# Altium schematic sheet Oscilador.SchDoc
size A4
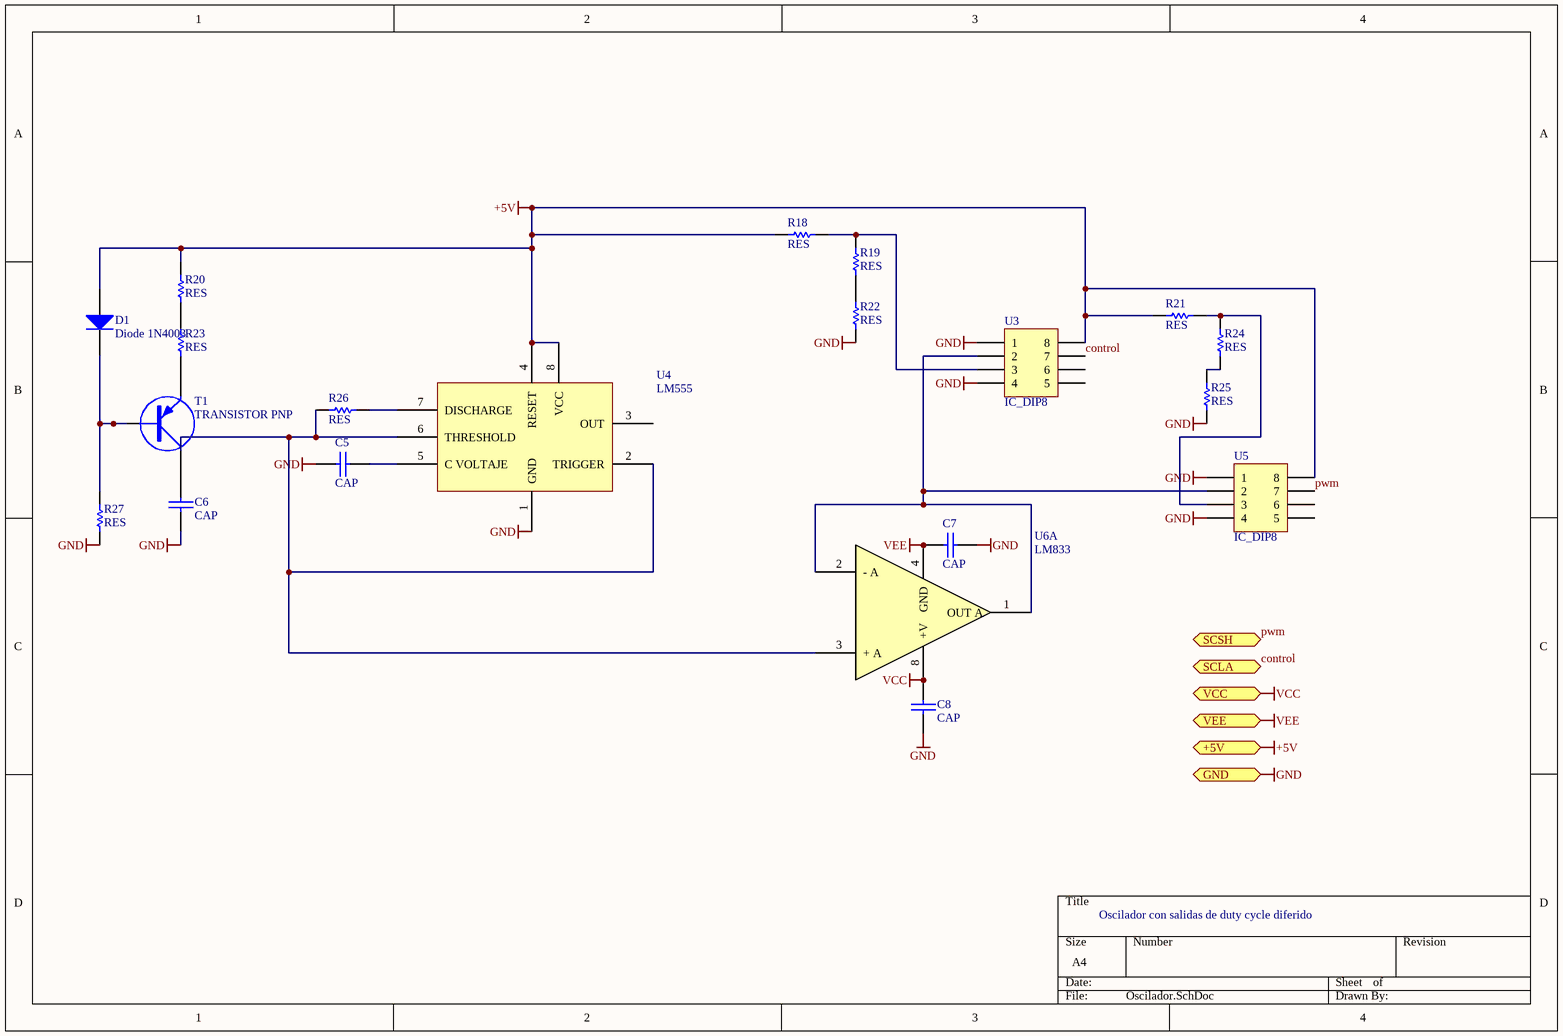
[diagram p0: Oscilador.SchDoc]

## Parts
C5  CAP  [CAP100]
C6  CAP  [CAP100]
C7  CAP  [CAP100]
C8  CAP  [CAP100]
D1  Diode 1N4003  [DO-41]
R18  RES  [RES300]
R19  RES  [RES300]
R20  RES  [RES300]
R21  RES  [RES300]
R22  RES  [RES300]
R23  RES  [RES300]
R24  RES  [RES300]
R25  RES  [RES300]
R26  RES  [RES300]
R27  RES  [RES300]
T1  TRANSISTOR PNP  [TO92]
U3  IC_DIP8  [DIP8]
U4  LM555  [DIP8]
U5  IC_DIP8  [DIP8]
U6  LM833  [DIP8]  (part A of 2)

## Ports
+5V, GND, SCLA, SCSH, VCC, VEE

## Nets
+5V: D1.1(A) R18.1 R20.2 R21.1 U3.8 U4.4(RESET) U4.8(VCC) U5.8 ; port +5V
GND: C5.2 C6.2 C7.2 C8.2 R22.1 R25.1 R27.1 U3.1 U3.4 U4.1(GND) U5.1 U5.4 ; port GND
VCC: C8.1 U6.8(+V) ; port VCC
VEE: C7.1 U6.4(GND) ; port VEE
control: U3.7 ; port SCLA
pwm: U5.7 ; port SCSH
NetC5_1: C5.1 U4.5(C_VOLTAJE)
NetC6_1: C6.1 T1.2(C)
NetD1_2: D1.2(K) R27.2 T1.1(B)
NetR18_2: R18.2 R19.2 U3.3
NetR19_1: R19.1 R22.2
NetR20_1: R20.1 R23.2
NetR21_2: R21.2 R24.2 U5.3
NetR23_1: R23.1 T1.3(E)
NetR24_1: R24.1 R25.2
NetR26_1: R26.1 U4.2(TRIGGER) U4.6(THRESHOLD) U6.3(+_A)
NetR26_2: R26.2 U4.7(DISCHARGE)
NetU3_2: U3.2 U5.2 U6.1(OUT_A) U6.2(-_A)

Not connected (* = marked no-connect by the designer): U3 5 6; U4 3(OUT); U5 5 6

## Notes on the sheet
- Oscilador con salidas de duty cycle diferido

## Library data of the parts
D1 = Diode 1N4003: 1 Amp General Purpose Rectifier; Published: 8-Jun-2000; LatestRevisionDate: 17-Jul-2002; LatestRevisionNote: Re-released for DXP Platform.; DatasheetVersion: 1998; PackageVersion: Aug-1999; PackageReference: DO-41; Publisher: Altium Limited; PackageDescription: Diode, Axial; Body 5.2 x 2.7 mm (LxDia. max), Lead Dia. 0.86 mm (max); Code_JEDEC: DO-204-AL; ComponentLink1Description: Manufacturer Link; ComponentLink1URL: http://www.fairchildsemi.com/; ComponentLink2Description: Datasheet; ComponentLink2URL: http://www.fairchildsemi.com/ds/1N%2F1N4001.pdf
U4 = LM555: Timer
U6 = LM833: Dual Audio Operational Amplifier